# EAGLE design module_RF69 (EAGLE 9.4.1)
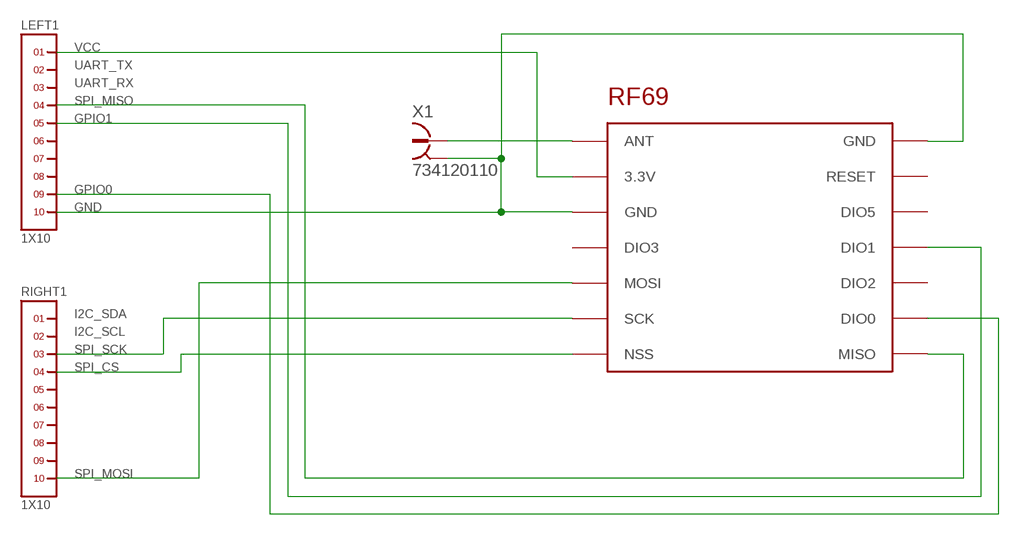
[diagram p0: schematic, sheet 1]

## Parts
LEFT1  1X10  [1X10]
RIGHT1  1X10  [1X10]
U$1  RF69  [RF69]
X1  734120110  [734120110]

## Nets
GND: LEFT1.10 U$1.GND@1(GND) U$1.GND@2(GND) X1.S@1 X1.S@2 X1.S@3
INT0: LEFT1.9 U$1.DIO0
INT1: LEFT1.5 U$1.DIO1
N$1: U$1.ANT X1.1
SPI_CS: RIGHT1.4 U$1.NSS
SPI_MISO: LEFT1.4 U$1.MISO
SPI_MOSI: RIGHT1.10 U$1.MOSI
SPI_SCK: RIGHT1.3 U$1.SCK
VCC: LEFT1.1 U$1.3.3V
Unconnected: LEFT1.2 LEFT1.3 LEFT1.6 LEFT1.7 LEFT1.8 RIGHT1.1 RIGHT1.2 RIGHT1.5 RIGHT1.6 RIGHT1.7 RIGHT1.8 RIGHT1.9 U$1.DIO2 U$1.DIO3 U$1.DIO5 U$1.RESET

## Notes on the sheet
- VCC
- UART_TX
- UART_RX
- SPI_MISO
- GPIO1
- GPIO0
- GND
- I2C_SDA
- I2C_SCL
- SPI_SCK
- SPI_CS
- SPI_MOSI

## Library data of the parts
LEFT1 RIGHT1 = headers(2mm):1X10
U$1 = RadioShield:RF69
X1 = con-coax:734120110: MICRO COAXIAL CONNECTOR RECEPTACLE VERTICAL Source: Data sheet <http://www.molex.com/pdm_docs/sd/734120110_sd.pdf>

## Board
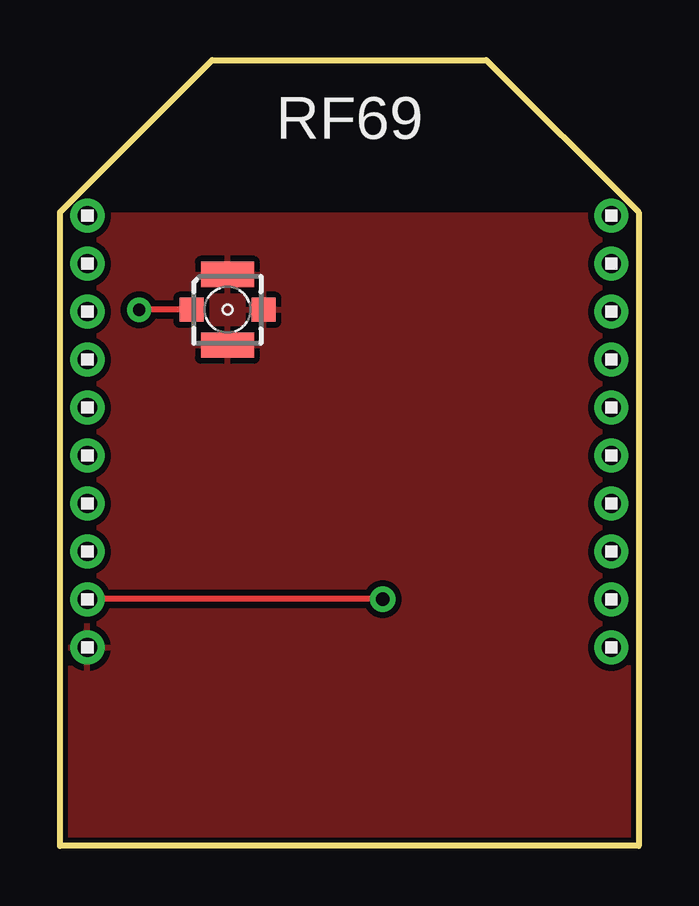
[diagram p1: board, top side]
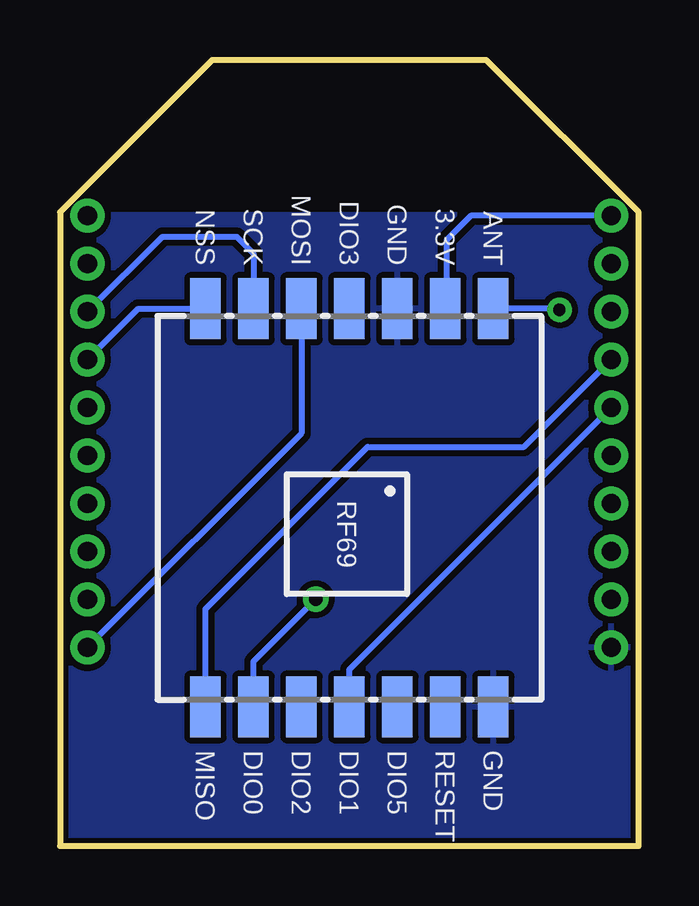
[diagram p2: board, bottom side, seen from below]

Size 24.13 x 32.77 mm. Coordinates in mm from the lower left corner, seen from the top.
Outline: 0,0 0,26.42 6.35,32.77 17.78,32.77 24.13,26.42 24.13,0 0,0
Copper layers (1*16): Top 0.035mm / dielectric 1.5mm / Bottom 0.035mm
Design rules "SparkFun-2-layer-STANDARD": minimum track width 10mil, minimum drill 20mil, track to track 10mil, track to pad 8mil, pad to pad 8mil, via to via 10mil, smd to smd 8mil, copper to edge 8mil, drill to drill 8mil, minimum pad ring 10mil, minimum via ring 10mil, stop-mask expansion 4mil, vias tented up to drill 25mil, thermal gap 10mil

### Footprints (pad centres in the part's own frame; a part is rotated, then mirrored left to right if it is on the bottom)
1X10 = drill 0.8 pad 1.422: 1 -9,0; 2 -7,0; 3 -5,0; 4 -3,0; 5 -1,0; 6 1,0; 7 3,0; 8 5,0; 9 7,0; 10 9,0
RF69 = smd 2.54 x 1.27: 3.3V -8.3,4; ANT -8.3,6; DIO0 8.3,-4; DIO1 8.3,0; DIO2 8.3,-2; DIO3 -8.3,0; DIO5 8.3,2; GND@1 -8.3,2; GND@2 8.3,6; MISO 8.3,-6; MOSI -8.3,-2; NSS -8.3,-6; RESET 8.3,4; SCK -8.3,-4
734120110 = smd 1 x 1: 1 0,-1.5; S@1 0,1.5 | smd 1.05 x 2.2: S@2 -1.475,0; S@3 1.475,0

### Placement (x,y rotation side)
LEFT1  1.14,17.27 270 top
RIGHT1  22.99,17.27 270 top
U$1  12.06,14.1 270 bottom
X1  6.99,22.35 270 top

### Tracks (layer width: path | path; a pad name or v marks a point on that pad's centre or on a via)
GND
  pour Bottom: -0.51,-0.51 -0.51,26.29 24.64,26.29 24.64,-0.51
  pour Top: -0.25,-0.25 -0.25,26.29 24.38,26.29 24.38,-0.25
INT0  (via drill 0.55)
  Top 0.254: v13.46,10.29 1.16,10.29 LEFT1.9
  Bottom 0.254: U$1.DIO0 16.07,7.68 v13.46,10.29
INT1
  Bottom 0.254: U$1.DIO1 12.06,7.35 LEFT1.5
N$1  (via drill 0.51)
  Top 0.254: X1.1 v3.3,22.35
  Bottom 0.254: v3.3,22.35 3.35,22.4 U$1.ANT
SPI_CS
  Bottom 0.254: U$1.NSS 20.86,22.4 RIGHT1.4
SPI_MISO
  Bottom 0.254: LEFT1.4 4.78,16.64 11.3,16.64 18.07,9.88 U$1.MISO
SPI_MOSI
  Bottom 0.254: U$1.MOSI 14.06,17.19 RIGHT1.10
SPI_SCK
  Bottom 0.254: RIGHT1.3 19.86,25.4 16.76,25.4 16.07,24.7 U$1.SCK
VCC
  Bottom 0.254: LEFT1.1 7,26.27 8,25.27 8,22.46 U$1.3.3V

### Text on the board
tNames: RF69